# Altium project ToF-Level-Shifter-Breakout.PrjPcb
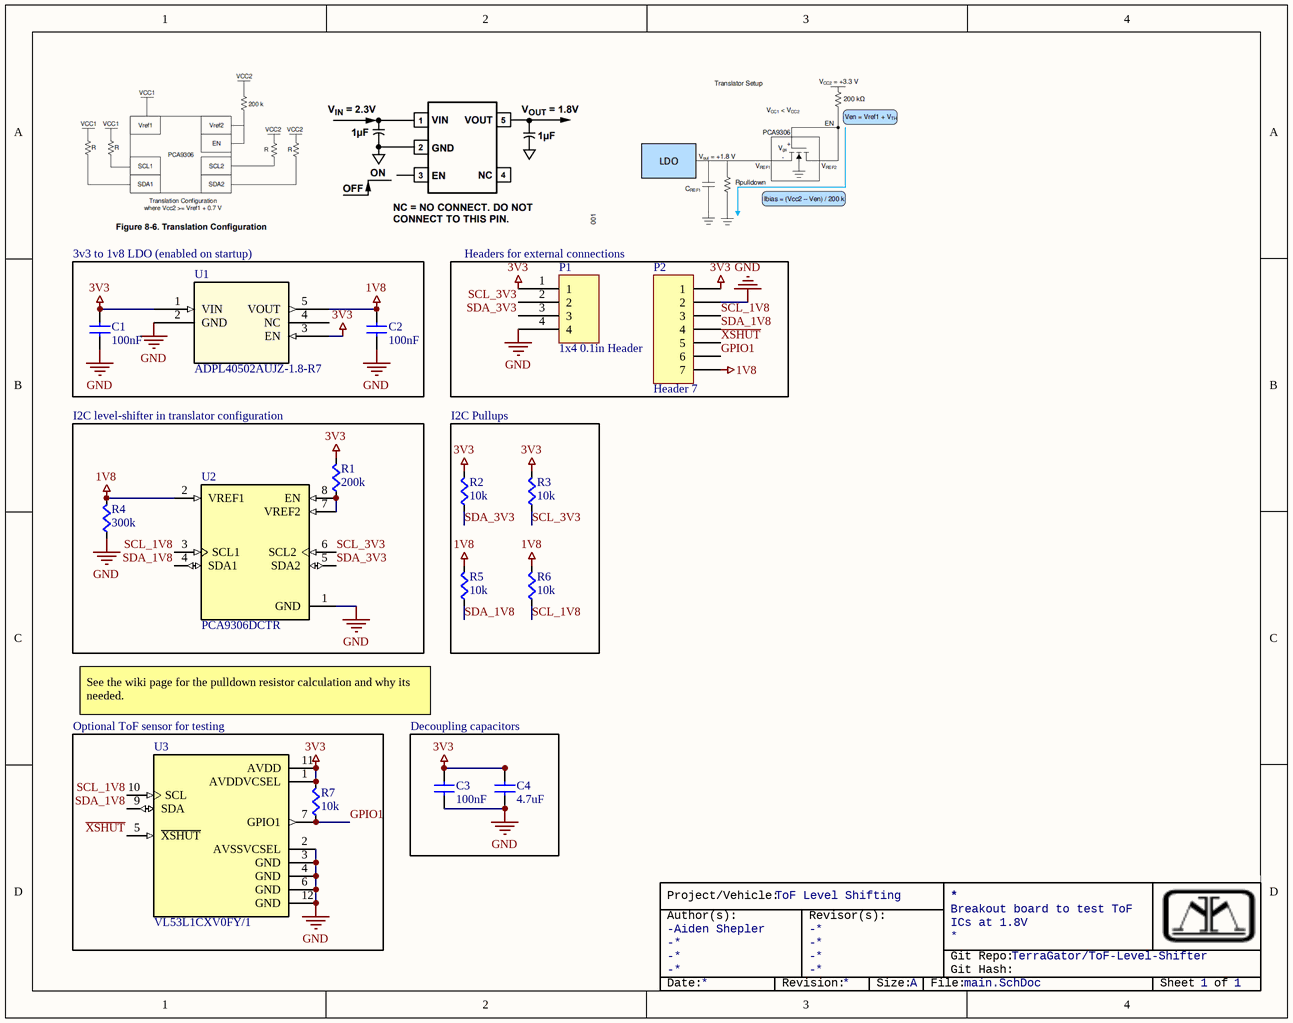
[diagram p0: main.SchDoc]
1 sheet, 16 parts. Net scope: global (net labels, ports and power ports of the same name join across sheets).
Board file: main.PcbDoc

## Sheet main.SchDoc
size A; Address1: Breakout board to test ToF; Address2: ICs at 1.8V; SheetNumber: 1; SheetTotal: 1; Project: ToF Level Shifting; Author1: Aiden Shepler; VersionControl_Repository: TerraGator/ToF-Level-Shifter

### Parts
C1  value 100nF  [CAPC0603]  (hidden comment: Cap)
C2  value 100nF  [CAPC0603]  (hidden comment: Cap)
C3  value 100nF  [CAPC0603]  (hidden comment: Cap)
C4  value 4.7uF  [CAPC0603]  (hidden comment: Cap)
P1  1x4 0.1in Header  [1x4 0.1in Header]
P2  Header 7  [HDR1X7]
R1  value 200k  [RES0603]  (hidden comment: Res)
R2  value 10k  [RES0603]  (hidden comment: Res)
R3  value 10k  [RES0603]  (hidden comment: Res)
R4  value 300k  [RES0603]  (hidden comment: Res)
R5  value 10k  [RES0603]  (hidden comment: Res)
R6  value 10k  [RES0603]  (hidden comment: Res)
R7  value 10k  [RES0603]  (hidden comment: Res)
U1  ADPL40502AUJZ-1.8-R7  [TSOT-23-5_UJ-5_ADI]
U2  PCA9306DCTR  [SOP65P400X130-8N]
U3  VL53L1CXV0FY/1  [LGA-12 (VL53L1CXV0FY/1)]

### Blocks framed on the sheet
3v3 to 1v8 LDO (enabled on startup): C1 C2 U1
Headers for external connections: P1 P2
I2C level-shifter in translator configuration: R1 R4 U2
I2C Pullups: R2 R3 R5 R6
Optional ToF sensor for testing: R7 U3
Decoupling capacitors: C3 C4

### Nets
1V8: C2.1(A) P2.7 R4.1(A) R5.1(A) R6.1(A) U1.5(VOUT) U2.2(VREF1)
3V3: C1.1(A) C3.1(A) C4.1(A) P1.1 P2.1 R1.1(A) R2.1(A) R3.1(A) R7.1(A) U1.1(VIN) U1.3(EN) U3.1(AVDDVCSEL) U3.11(AVDD)
GND: C1.2(B) C2.2(B) C3.2(B) C4.2(B) P1.4 P2.2 R4.2(B) U1.2(GND) U2.1(GND) U3.2(AVSSVCSEL) U3.3(GND) U3.4(GND) U3.6(GND) U3.12(GND)
GPIO1: P2.6 R7.2(B) U3.7(GPIO1)
SCL_1V8: P2.3 R6.2(B) U2.3(SCL1) U3.10(SCL)
SCL_3V3: P1.2 R3.2(B) U2.6(SCL2)
SDA_1V8: P2.4 R5.2(B) U2.4(SDA1) U3.9(SDA)
SDA_3V3: P1.3 R2.2(B) U2.5(SDA2)
~{XSHUT}: P2.5 U3.5(~{XSHUT})
NetR1_2: R1.2(B) U2.7(VREF2) U2.8(EN)

Not connected (* = marked no-connect by the designer): U1 4(NC)

### Notes on the sheet
- See the wiki page for the pulldown resistor calculation and why its needed.
- Project/Vehicle:
- Author(s):
- -
- Revisor(s):
- Git Repo:
- Git Hash:
- Date:
- Revision:
- Size:
- A
- File:
- Sheet
- of

### Library data of the parts
P2 = Header 7: Header, 7-Pin; LatestRevisionDate: 17-Jul-2002; LatestRevisionNote: Re-released for DXP Platform.; Publisher: Altium Limited
R1-R7 = Res: SMD, RES0603; Supplier 1: Digi-Key; Supplier Part Number 1: RMCF0603JT10K0CT-ND
U1 = ADPL40502AUJZ-1.8-R7: Low Noise, 200mA, CMOS Linear Regulator (LDO); Manufacturer_Name: Analog Devices Inc; Copyright: Copyright (C) 2025 Ultra Librarian. All rights reserved.; Manufacturer_Part_Number: ADPL40502AUJZ-1.8-R7; RefDes: RefDes; Type: Type
U2 = PCA9306DCTR: 2-bit bidirectional 400-kHz I2C/SMBus voltage level translator; MF: Texas Instruments; SnapEDA_Link: https://www.snapeda.com/parts/PCA9306DCTR/Texas+Instruments/view-part/?ref=snap; Package: SSOP-8 Texas Instruments; Value: *; MP: PCA9306DCTR; Check_prices: https://www.snapeda.com/parts/PCA9306DCTR/Texas+Instruments/view-part/?ref=eda
U3 = VL53L1CXV0FY/1: ToF Optical Sensor 157.480 (4m) I²C Output from STMelectronics; MF: STMicroelectronics; SnapEDA_Link: https://www.snapeda.com/parts/VL53L1CXV0FY/1/STMicroelectronics/view-part/?ref=snap; Package: LGA-12 STMicroelectronics; MP: VL53L1CXV0FY/1; Check_prices: https://www.snapeda.com/parts/VL53L1CXV0FY/1/STMicroelectronics/view-part/?ref=eda; Purchase-URL: https://pricing.snapeda.com/search/part/VL53L1CXV0FY/1/?ref=eda; Price: None; Value: *; Availability: In Stock
C1-C4 = Cap: Supplier 1: Digi-Key; Supplier Part Number 1: 1276-1000-1-ND